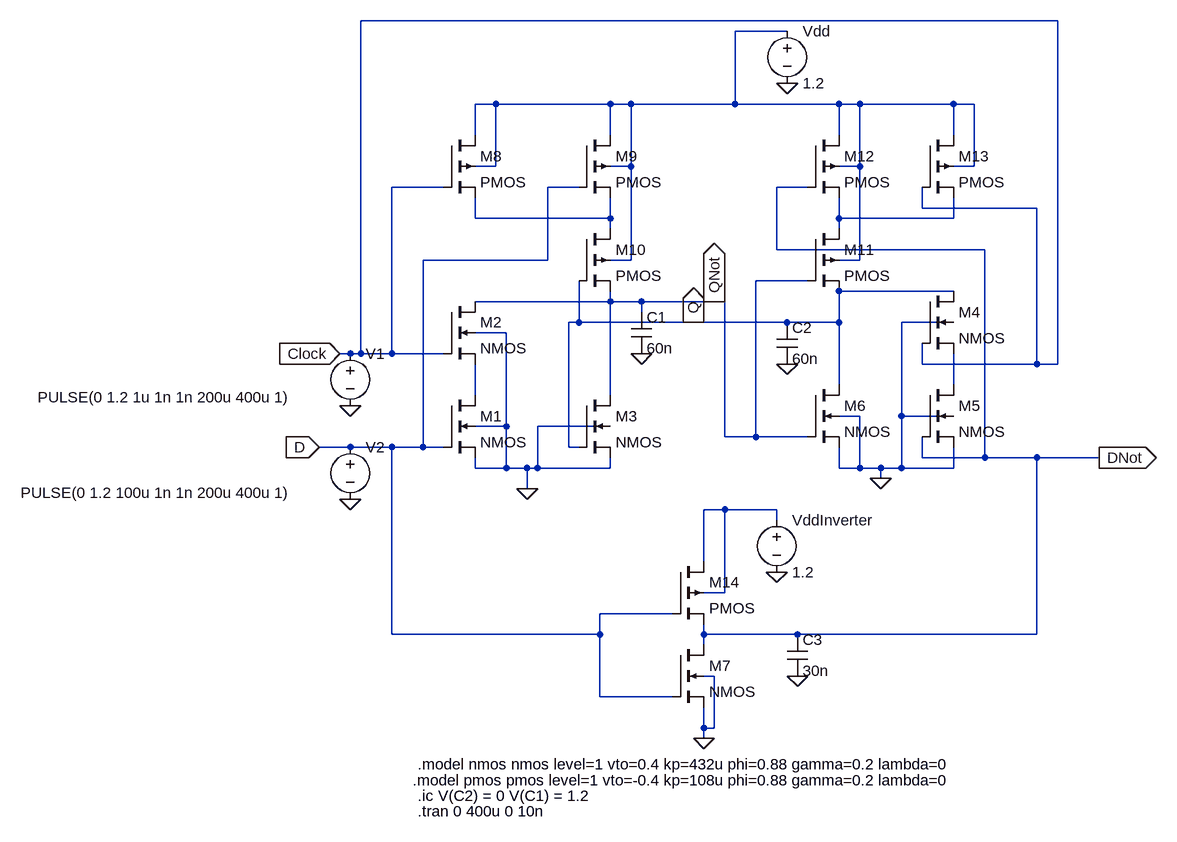
[diagram p0: schematic Lab05Pt1.asc]
Lab05Pt1.asc, the LTspice schematic file:
Version 4
SHEET 1 1336 736
WIRE 896 -496 -176 -496
WIRE 480 -480 400 -480
WIRE 32 -368 0 -368
WIRE 208 -368 32 -368
WIRE 240 -368 208 -368
WIRE 400 -368 400 -480
WIRE 400 -368 240 -368
WIRE 560 -368 400 -368
WIRE 592 -368 560 -368
WIRE 736 -368 592 -368
WIRE 768 -368 736 -368
WIRE 0 -320 0 -368
WIRE 208 -320 208 -368
WIRE 560 -320 560 -368
WIRE 736 -320 736 -368
WIRE 32 -272 32 -368
WIRE 32 -272 0 -272
WIRE 240 -272 240 -368
WIRE 240 -272 208 -272
WIRE 592 -272 592 -368
WIRE 592 -272 560 -272
WIRE 768 -272 768 -368
WIRE 768 -272 736 -272
WIRE -48 -240 -128 -240
WIRE 160 -240 112 -240
WIRE 512 -240 464 -240
WIRE 688 -208 688 -240
WIRE 864 -208 688 -208
WIRE 0 -192 0 -224
WIRE 208 -192 208 -224
WIRE 208 -192 0 -192
WIRE 560 -192 560 -224
WIRE 736 -192 736 -224
WIRE 736 -192 560 -192
WIRE 208 -176 208 -192
WIRE 560 -176 560 -192
WIRE 464 -144 464 -240
WIRE 784 -144 464 -144
WIRE 112 -128 112 -240
WIRE 112 -128 -80 -128
WIRE 240 -128 240 -272
WIRE 240 -128 208 -128
WIRE 592 -128 592 -272
WIRE 592 -128 560 -128
WIRE 512 -96 432 -96
WIRE 736 -80 560 -80
WIRE 208 -64 208 -80
WIRE 208 -64 0 -64
WIRE 256 -64 208 -64
WIRE 368 -64 256 -64
WIRE 384 -64 368 -64
WIRE 256 -48 256 -64
WIRE 160 -32 160 -96
WIRE 160 -32 144 -32
WIRE 336 -32 160 -32
WIRE 480 -32 336 -32
WIRE 560 -32 560 -80
WIRE 560 -32 480 -32
WIRE 736 -32 656 -32
WIRE 48 -16 0 -16
WIRE -192 16 -208 16
WIRE -176 16 -176 -496
WIRE -176 16 -192 16
WIRE -128 16 -128 -240
WIRE -128 16 -176 16
WIRE -48 16 -128 16
WIRE 688 32 688 0
WIRE 864 32 864 -208
WIRE 864 32 688 32
WIRE 896 32 896 -496
WIRE 896 32 864 32
WIRE 560 64 560 -32
WIRE 736 64 736 16
WIRE 0 80 0 32
WIRE 208 80 208 -64
WIRE 592 112 560 112
WIRE 656 112 656 -32
WIRE 736 112 656 112
WIRE 48 128 48 -16
WIRE 48 128 0 128
WIRE 208 128 96 128
WIRE 384 144 384 -64
WIRE 432 144 432 -96
WIRE 432 144 384 144
WIRE 512 144 432 144
WIRE -192 160 -240 160
WIRE -128 160 -192 160
WIRE -80 160 -80 -128
WIRE -80 160 -128 160
WIRE -48 160 -80 160
WIRE 144 160 144 -32
WIRE 160 160 144 160
WIRE 688 176 688 144
WIRE 784 176 784 -144
WIRE 784 176 688 176
WIRE 864 176 784 176
WIRE 960 176 864 176
WIRE 0 192 0 176
WIRE 48 192 48 128
WIRE 48 192 0 192
WIRE 80 192 48 192
WIRE 96 192 96 128
WIRE 96 192 80 192
WIRE 208 192 208 176
WIRE 208 192 96 192
WIRE 560 192 560 160
WIRE 592 192 592 112
WIRE 592 192 560 192
WIRE 624 192 592 192
WIRE 656 192 656 112
WIRE 656 192 624 192
WIRE 736 192 736 160
WIRE 736 192 656 192
WIRE 624 208 624 192
WIRE 80 224 80 192
WIRE 384 256 352 256
WIRE 464 256 384 256
WIRE 464 272 464 256
WIRE 352 336 352 256
WIRE 384 384 384 256
WIRE 384 384 352 384
WIRE 304 416 192 416
WIRE -128 448 -128 160
WIRE 192 448 192 416
WIRE 192 448 -128 448
WIRE 352 448 352 432
WIRE 496 448 352 448
WIRE 864 448 864 176
WIRE 864 448 496 448
WIRE 352 464 352 448
WIRE 368 512 352 512
WIRE 192 544 192 448
WIRE 304 544 192 544
WIRE 352 592 352 560
WIRE 368 592 368 512
WIRE 368 592 352 592
WIRE 352 608 352 592
FLAG 80 224 0
FLAG 352 608 0
FLAG 624 208 0
FLAG 256 16 0
FLAG 480 32 0
FLAG 496 512 0
FLAG 336 -32 Q
IOPIN 336 -32 Out
FLAG 368 -64 QNot
IOPIN 368 -64 Out
FLAG 464 352 0
FLAG 480 -400 0
FLAG -208 16 Clock
IOPIN -208 16 In
FLAG -240 160 D
IOPIN -240 160 In
FLAG 960 176 DNot
IOPIN 960 176 Out
FLAG -192 96 0
FLAG -192 240 0
SYMBOL nmos4 -48 80 R0
SYMATTR InstName M1
SYMATTR Value2 l=0.1u w=4u
SYMBOL nmos4 -48 -64 R0
SYMATTR InstName M2
SYMATTR Value2 l=0.1u w=4u
SYMBOL nmos4 160 80 R0
SYMATTR InstName M3
SYMBOL nmos4 688 -80 R0
SYMATTR InstName M4
SYMATTR Value2 l=0.1u w=4u
SYMBOL nmos4 688 64 R0
SYMATTR InstName M5
SYMATTR Value2 l=0.1u w=4u
SYMBOL nmos4 512 64 R0
SYMATTR InstName M6
SYMATTR Value2 l=0.1u w=4u
SYMBOL nmos4 304 464 R0
SYMATTR InstName M7
SYMATTR Value2 l=0.1u w=2u
SYMBOL pmos4 -48 -320 R0
SYMATTR InstName M8
SYMATTR Value2 l=0.1u w=16u
SYMBOL pmos4 160 -320 R0
SYMATTR InstName M9
SYMATTR Value2 l=0.1u w=16u
SYMBOL pmos4 160 -176 R0
SYMATTR InstName M10
SYMATTR Value2 l=0.1u w=16u
SYMBOL pmos4 512 -176 R0
SYMATTR InstName M11
SYMATTR Value2 l=0.1u w=16u
SYMBOL pmos4 512 -320 R0
SYMATTR InstName M12
SYMATTR Value2 l=0.1u w=16u
SYMBOL pmos4 688 -320 R0
SYMATTR InstName M13
SYMATTR Value2 l=0.1u w=16u
SYMBOL pmos4 304 336 R0
SYMATTR InstName M14
SYMATTR Value2 l=0.1u w=8u
SYMBOL cap 240 -48 R0
SYMATTR InstName C1
SYMATTR Value 60n
SYMBOL cap 464 -32 R0
SYMATTR InstName C2
SYMATTR Value 60n
SYMBOL cap 480 448 R0
SYMATTR InstName C3
SYMATTR Value 30n
SYMBOL voltage 480 -496 R0
WINDOW 123 0 0 Left 0
WINDOW 39 0 0 Left 0
SYMATTR InstName Vdd
SYMATTR Value 1.2
SYMBOL voltage 464 256 R0
WINDOW 123 0 0 Left 0
WINDOW 39 0 0 Left 0
SYMATTR InstName VddInverter
SYMATTR Value 1.2
SYMBOL voltage -192 0 R0
WINDOW 3 -481 83 Left 2
WINDOW 123 0 0 Left 0
WINDOW 39 0 0 Left 0
SYMATTR Value PULSE(0 1.2 1u 1n 1n 200u 400u 1)
SYMATTR InstName V1
SYMBOL voltage -192 144 R0
WINDOW 3 -507 86 Left 2
WINDOW 123 0 0 Left 0
WINDOW 39 0 0 Left 0
SYMATTR Value PULSE(0 1.2 100u 1n 1n 200u 400u 1)
SYMATTR InstName V2
TEXT -88 648 Left 2 !.model nmos nmos level=1 vto=0.4 kp=432u phi=0.88 gamma=0.2 lambda=0
TEXT -96 672 Left 2 !.model pmos pmos level=1 vto=-0.4 kp=108u phi=0.88 gamma=0.2 lambda=0
TEXT -88 696 Left 2 !.ic V(C2) = 0 V(C1) = 1.2
TEXT -88 720 Left 2 !.tran 0 400u 0 10n

The netlist it stands for:
* Lab05Pt1.asc
M1 N005 D 0 0 NMOS l=0.1u w=4u
M2 QNot Clock N005 0 NMOS l=0.1u w=4u
M3 QNot Q 0 0 NMOS
M4 Q Clock N004 0 NMOS l=0.1u w=4u
M5 N004 DNot 0 0 NMOS l=0.1u w=4u
M6 Q QNot 0 0 NMOS l=0.1u w=4u
M7 DNot D 0 0 NMOS l=0.1u w=2u
M8 N001 Clock N002 N001 PMOS l=0.1u w=16u
M9 N001 D N002 N001 PMOS l=0.1u w=16u
M10 N002 Q QNot N001 PMOS l=0.1u w=16u
M11 N003 QNot Q N001 PMOS l=0.1u w=16u
M12 N001 DNot N003 N001 PMOS l=0.1u w=16u
M13 N001 Clock N003 N001 PMOS l=0.1u w=16u
M14 N006 D DNot N006 PMOS l=0.1u w=8u
C1 QNot 0 60n
C2 Q 0 60n
C3 DNot 0 30n
Vdd N001 0 1.2
VddInverter N006 0 1.2
V1 Clock 0 PULSE(0 1.2 1u 1n 1n 200u 400u 1)
V2 D 0 PULSE(0 1.2 100u 1n 1n 200u 400u 1)
.model NMOS NMOS
.model PMOS PMOS
.lib standard.mos
.model nmos nmos level=1 vto=0.4 kp=432u phi=0.88 gamma=0.2 lambda=0
.model pmos pmos level=1 vto=-0.4 kp=108u phi=0.88 gamma=0.2 lambda=0
.ic V(C2) = 0 V(C1) = 1.2
.tran 0 400u 0 10n
.backanno
.end

* Results of the author's LTspice run, read from the files saved beside the schematic
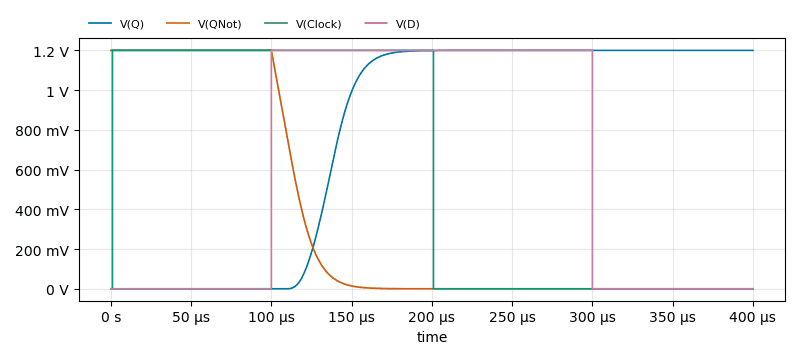
[diagram p1: Transient Analysis of Lab05Pt1.asc, plotted from the saved traces]
* Transient Analysis, 1 run:
*   V(Q): min 0 V, max 1.2 V, average 784.9 mV, rms 956.9 mV, last 1.2 V
*   V(QNot): min 9.718 µV, max 1.2 V, average 347.1 mV, rms 627.7 mV, last 9.718 µV
*   V(Clock): min 0 V, max 1.2 V, average 600 mV, rms 848.5 mV, last 0 V
*   V(D): min 0 V, max 1.2 V, average 600 mV, rms 848.5 mV, last 0 V